# EAGLE design MD Switchless (EAGLE 9.6.2)
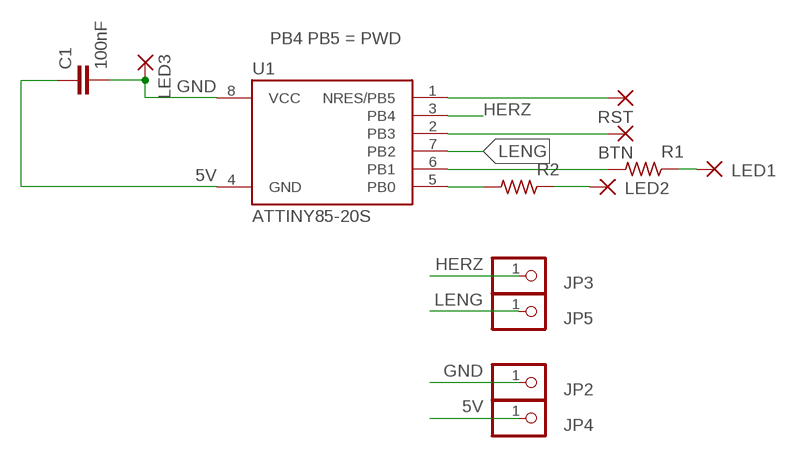
[diagram p0: schematic, sheet 1]

## Parts
BTN  WIREPADSMD1,27-254  [SMD1,27-2,54]
C1  100nF  1.0UF-0805-25V-10%  [0805]
JP2  PINHD-1X1  [1X01]
JP3  PINHD-1X1  [1X01]
JP4  PINHD-1X1  [1X01]
JP5  PINHD-1X1  [1X01]
LED1  WIREPADSMD1,27-254  [SMD1,27-2,54]
LED2  WIREPADSMD1,27-254  [SMD1,27-2,54]
LED3  WIREPADSMD1,27-254  [SMD1,27-2,54]
R1  R_0805  [R0805]
R2  R_0805  [R0805]
RST  WIREPADSMD1,27-254  [SMD1,27-2,54]
U1  ATTINY85-20S  [SOIC8_EIAJ_208MIL]

## Nets
5V [vcc]: C1.1 JP4.1 U1.4(GND)
BTN: BTN.1(P) U1.2(PB3)
GND: C1.2 JP2.1 LED3.1(P) U1.8(VCC)
HERZ: JP3.1 U1.3(PB4)
L1: LED1.1(P) R1.2
L2: LED2.1(P) R2.2
LENG: JP5.1 U1.7(PB2)
RL1: R1.1 U1.6(PB1)
RL2: R2.1 U1.5(PB0)
RST: RST.1(P) U1.1(NRES/PB5)

## Notes on the sheet
- PB4 PB5 = PWD

## Library data of the parts
BTN LED1-LED3 RST = wirepad:WIREPAD: Wire PAD connect wire on PCB
C1 = SparkFun-Capacitors:1.0UF: 1µF ceramic capacitors A capacitor is a passive two-terminal electrical component used to store electrical energy temporarily in an electric field.; PROD_ID: CAP-08064; VALUE: 1.0uF
JP2-JP5 = pinhead:PINHD-1X1: PIN HEADER
R1 R2 = rc-master-smd:R_: RESISTOR
U1 = _hhn_attiny25_45_85:ATTINY85*: ATMEL ATtiny 85 Packages: P = PDIP 08 30mil S = SOIC 08 EIAJ 208mil Technologies Note: for complete ordering code (temp. range, finish, tape&reel etc.) see www.atmel.com • Supply Voltage: V = (1.8…5.5)V | [blank] = (2.7…5.5)V • Speed: 10 = 10 MHz | 20 = 20 MHz Author: Dipl.-Ing. FH Rainer Bayer HHN Hochschule Heilbronn (Heilbronn University), rainer.bayer@hs-heilbronn.de Ingenieurbüro ing-rb, mail@ing-rb.de

## Net classes
0 default: width 0.203 mm
1 gnd: width 0.406 mm
2 vcc: width 0.406 mm

## Board
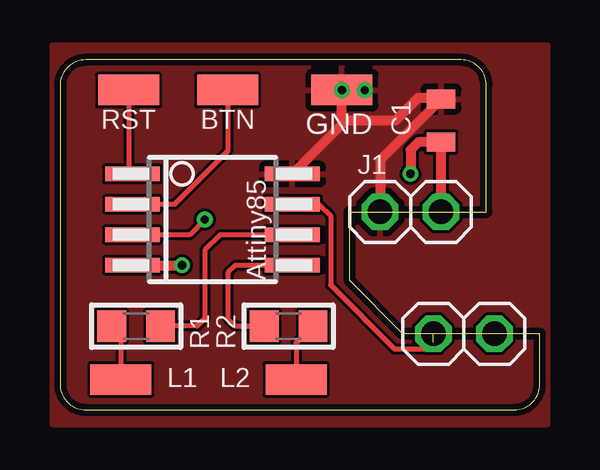
[diagram p1: board, top side]
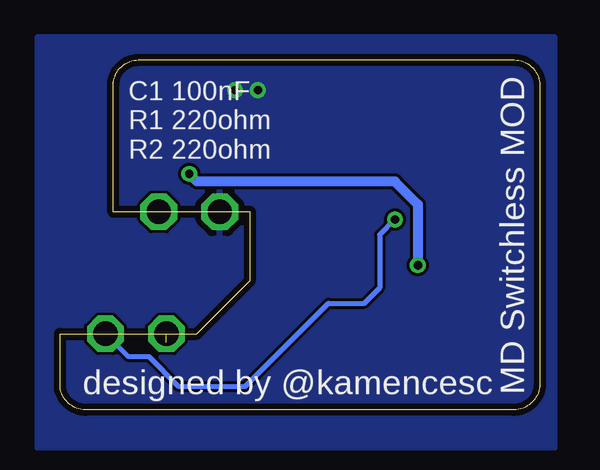
[diagram p2: board, bottom side, seen from below]

Size 19.99 x 14.6 mm. Coordinates in mm from the lower left corner, seen from the top.
Outline: 17.77,8.26 17.77,13.55 arc90 16.72,14.6 1.07,14.6 arc90 0,13.53 0,1.08 arc90 1.08,0 18.93,0 arc90 19.99,1.06 19.99,3.17 14.29,3.17 12.06,5.4 12.06,8.26 17.77,8.26
Copper layers (1*16): Top 0.035mm / dielectric 1.5mm / Bottom 0.035mm
Design rules "dirtypcbs_2_layer": minimum track width 5mil, minimum drill 12mil, track to track 5mil, track to pad 5mil, pad to pad 5mil, via to via 5mil, smd to smd 0mil, copper to edge 10mil, drill to drill 10mil, minimum pad ring 10mil, minimum via ring 6mil, stop-mask expansion 2mil, vias tented up to drill 25mil, thermal gap 10mil

### Footprints (pad centres in the part's own frame; a part is rotated, then mirrored left to right if it is on the bottom)
SMD1,27-2,54 = smd 1.27 x 2.54: 1 0,0
0805 = smd 0.8 x 1.2: 1 -0.9,0; 2 0.9,0
1X01 = drill 1.016 octagon: 1 0,0
R0805 = smd 1.2 x 1.3: 1 -1.016,0; 2 1.016,0
SOIC8_EIAJ_208MIL = smd 0.6 x 2.286: 1 -1.905,-3.33; 2 -0.635,-3.33; 3 0.635,-3.33; 4 1.905,-3.33; 5 1.905,3.33; 6 0.635,3.33; 7 -0.635,3.33; 8 -1.905,3.33

### Placement (x,y rotation side)
BTN  6.99,13.34 90 top
C1  15.88,12.06 90 top
JP2  13.34,8.26 0 top
JP3  18.1,3.17 0 top
JP4  15.88,8.26 0 top
JP5  15.56,3.17 0 top
LED1  2.54,1.27 90 top
LED2  9.84,1.27 90 top
LED3  11.75,13.34 90 top
R1  3.17,3.49 180 top
R2  9.53,3.49 0 top
RST  2.86,13.34 90 top
U1  6.35,7.94 270 top

### Tracks (layer width: path | path; a pad name or v marks a point on that pad's centre or on a via)
5V  (via drill 0.35)
  Top 0.406: U1.4 v5.08,6.03 | JP4.1 C1.1 14.92,11.16 14.61,10.85 v14.61,9.84
  Bottom 0.406: v5.08,6.03 5.08,8.57 6.03,9.53 14.29,9.53 v14.61,9.84
BTN
  Top 0.203: BTN.1 6.99,10.79 4.76,8.57 U1.2
GND  (via drill 0.35)
  Top 0.203: 11.9,12.06 11.75,12.22
  Top 0.406: U1.8 11.9,12.06 13.97,12.06 14.92,13.02 15.82,13.02 C1.2 13.34,10.43 JP2.1 | v12.7,13.34 LED3.1 11.75,12.22
  other vias: 11.75,13.34
  pour Top: -0.32,15.24 20.32,15.24 20.32,-0.64 -0.32,-0.64
  pour Bottom: -0.64,15.56 20.95,15.56 20.95,-1.59 -0.64,-1.59
HERZ  (via drill 0.35)
  Top 0.203: v6.03,7.94 5.4,7.3 U1.3
  Bottom 0.203: JP3.1 17.14,2.22 16.29,2.22 15.06,0.99 12.27,0.99 8.81,4.45 7.3,4.45 6.67,5.08 6.67,7.3 v6.03,7.94
L1
  Top 0.203: R1.2 2.54,3.11 LED1.1
L2
  Top 0.203: R2.2 9.84,2.79 LED2.1
LENG  (1 unrouted)
  Top 0.203: U1.7 10.79,8.57 11.27,8.1 11.27,5.2 13.93,2.54 15.28,2.54 15.56,2.82
RL1
  Top 0.203: U1.6 6.67,7.3 6.03,6.67 6.03,3.81 5.71,3.49 R1.1
RL2
  Top 0.203: U1.5 7.3,6.03 7,5.73 7,3.8 7.3,3.49 R2.1
RST
  Top 0.203: RST.1 2.86,10.01 U1.1

### Text on the board
tPlace: J1 | Attiny85
bPlace: C1 100nF / R1 220ohm / R2 220ohm | MD Switchless MOD | designed by @kamencesc
tNames: GND | C1 | L1 | L2